# EAGLE design MDU(droid)v4.1 (EAGLE 9.1.3)

## Sheet 1 of 2: IC部
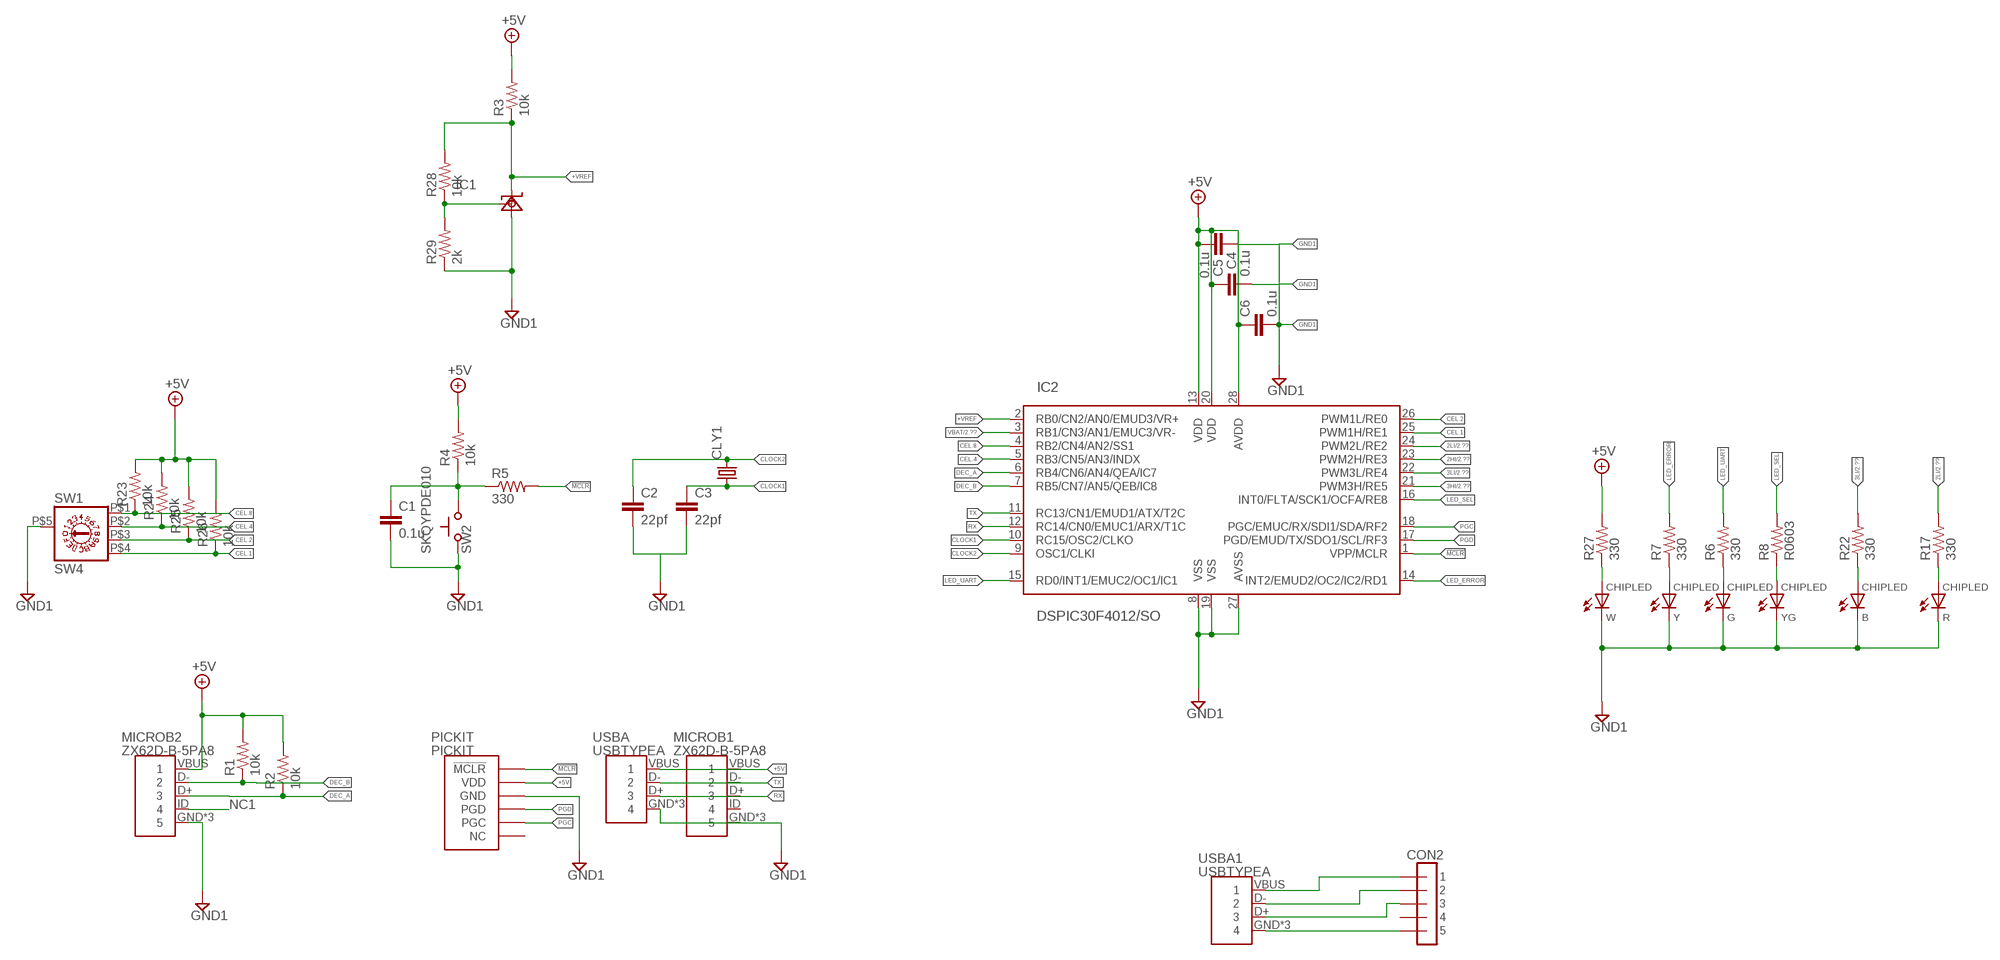
[diagram p0: schematic, sheet 1]

### Parts
B  CHIPLED  [CHIPLED_0603]
C1  0.1u  SOC  [C0603]
C2  22pf  SOC  [C0603]
C3  22pf  SOC  [C0603]
C4  0.1u  SOC  [C0603]
C5  0.1u  SOC  [C0603]
C6  0.1u  SOC  [C0603]
CLY1  CRYSTALHC49S  [HC49/S]
CON2  CON-5  [5-L]
G  CHIPLED  [CHIPLED_0603]
IC1  TA76431F  [SOT89]
IC2  DSPIC30F4012/SO  [SO-28W]
MICROB1  ZX62D-B-5PA8  [USB-B-MICRO-SMD]
MICROB2  ZX62D-B-5PA8  [USB-B-MICRO-SMD]
PICKIT  PICKIT  [1X06]
R  CHIPLED  [CHIPLED_0603]
R1  10k  SOR  [R0603]
R2  10k  SOR  [R0603]
R3  10k  SOR  [R0603]
R4  10k  SOR  [R0603]
R5  330  SOR  [R0603]
R6  330  SOR  [R0603]
R7  330  SOR  [R0603]
R8  R0603  [R0603]
R17  330  SOR  [R0603]
R22  330  SOR  [R0603]
R23  10k  R0603  [R0603]
R24  10k  R0603  [R0603]
R25  10k  R0603  [R0603]
R26  10k  R0603  [R0603]
R27  330  R0603  [R0603]
R28  10k  R0603  [R0603]
R29  2k  R0603  [R0603]
SW1  SW4  SC1010B  [DRS3016]
SW2  SKQYPDE010  [SKQYPDE010]
USBA  USBTYPEA  [USB-A-H]
USBA1  USBTYPEA  [USB-A-H]
W  CHIPLED  [CHIPLED_0603]
Y  CHIPLED  [CHIPLED_0603]
YG  CHIPLED  [CHIPLED_0603]

### Nets
2HI: IC2.23(PWM2H/RE3) ; also sheet 2
2LI [signal]: IC2.24(PWM2L/RE2) R17.2 ; also sheet 2
3HI [signal]: IC2.21(PWM3H/RE5) ; also sheet 2
3LI [signal]: IC2.22(PWM3L/RE4) R22.2 ; also sheet 2
!MCLR: IC2.1(VPP/MCLR) PICKIT.1(!MCLR) R5.2
+5V: C4.2 C5.1 C6.1 IC2.13(VDD) IC2.20(VDD) IC2.28(AVDD) MICROB1.VBUS MICROB2.VBUS PICKIT.2(VDD) R1.2 R2.2 R3.2 R4.2 R23.2 R24.2 R25.2 R26.2 R27.2 USBA.VBUS
+VREF: IC1.1(K) IC2.2(RB0/CN2/AN0/EMUD3/VR+) R3.1 R28.2
CEL.1 [signal]: IC2.25(PWM1H/RE1) R26.1 SW1.P$4
CEL.2 [signal]: IC2.26(PWM1L/RE0) R25.1 SW1.P$3
CEL.4 [signal]: IC2.5(RB3/CN5/AN3/INDX) R24.1 SW1.P$2
CEL.8 [signal]: IC2.4(RB2/CN4/AN2/SS1) R23.1 SW1.P$1
CLOCK1: C3.1 CLY1.1 IC2.10(RC15/OSC2/CLKO)
CLOCK2: C2.1 CLY1.2 IC2.9(OSC1/CLKI)
DEC_A: IC2.6(RB4/CN6/AN4/QEA/IC7) MICROB2.D+ R2.1
DEC_B: IC2.7(RB5/CN7/AN5/QEB/IC8) MICROB2.D- R1.1
GND1: B.C C1.2 C2.2 C3.2 C4.1 C5.2 C6.2 G.C IC1.2(A) IC1.2@1(A) IC2.8(VSS) IC2.19(VSS) IC2.27(AVSS) MICROB1.GND MICROB1.SHIELD1 MICROB1.SHIELD2 MICROB2.GND MICROB2.SHIELD1 MICROB2.SHIELD2 PICKIT.3(GND) R29.1 R.C SW1.P$5(C) SW2.SW1 USBA.GND USBA.SHLD1 USBA.SHLD2 W.C Y.C YG.C ; also sheet 2
LED_ERROR: IC2.14(INT2/EMUD2/OC2/IC2/RD1) R7.2
LED_SEL: IC2.16(INT0/FLTA/SCK1/OCFA/RE8) R8.2
LED_UART: IC2.15(RD0/INT1/EMUC2/OC1/IC1) R6.2
MCLR: C1.1 R4.1 R5.1 SW2.SW2
N$1: R27.1 W.A
N$2: G.A R6.1
N$3: R8.1 YG.A
N$4: IC1.3(REF) R28.1 R29.2
N$5: CON2.P$1 USBA1.VBUS
N$6: CON2.P$5 USBA1.GND USBA1.SHLD1 USBA1.SHLD2
N$7: CON2.P$2 USBA1.D-
N$8: R7.1 Y.A
N$9: R17.1 R.A
N$10: B.A R22.1
N$11: CON2.P$3 USBA1.D+
NC1: MICROB2.ID
PGC [signal]: IC2.18(PGC/EMUC/RX/SDI1/SDA/RF2) PICKIT.5(PGC)
PGD [signal]: IC2.17(PGD/EMUD/TX/SDO1/SCL/RF3) PICKIT.4(PGD)
RX: IC2.12(RC14/CN0/EMUC1/ARX/T1C) MICROB1.D+ USBA.D+
TX: IC2.11(RC13/CN1/EMUD1/ATX/T2C) MICROB1.D- USBA.D-
VBAT: IC2.3(RB1/CN3/AN1/EMUC3/VR-) ; also sheet 2
Unconnected: CON2.P$4 MICROB1.ID PICKIT.6(NC)

## Sheet 2 of 2: 駆動部
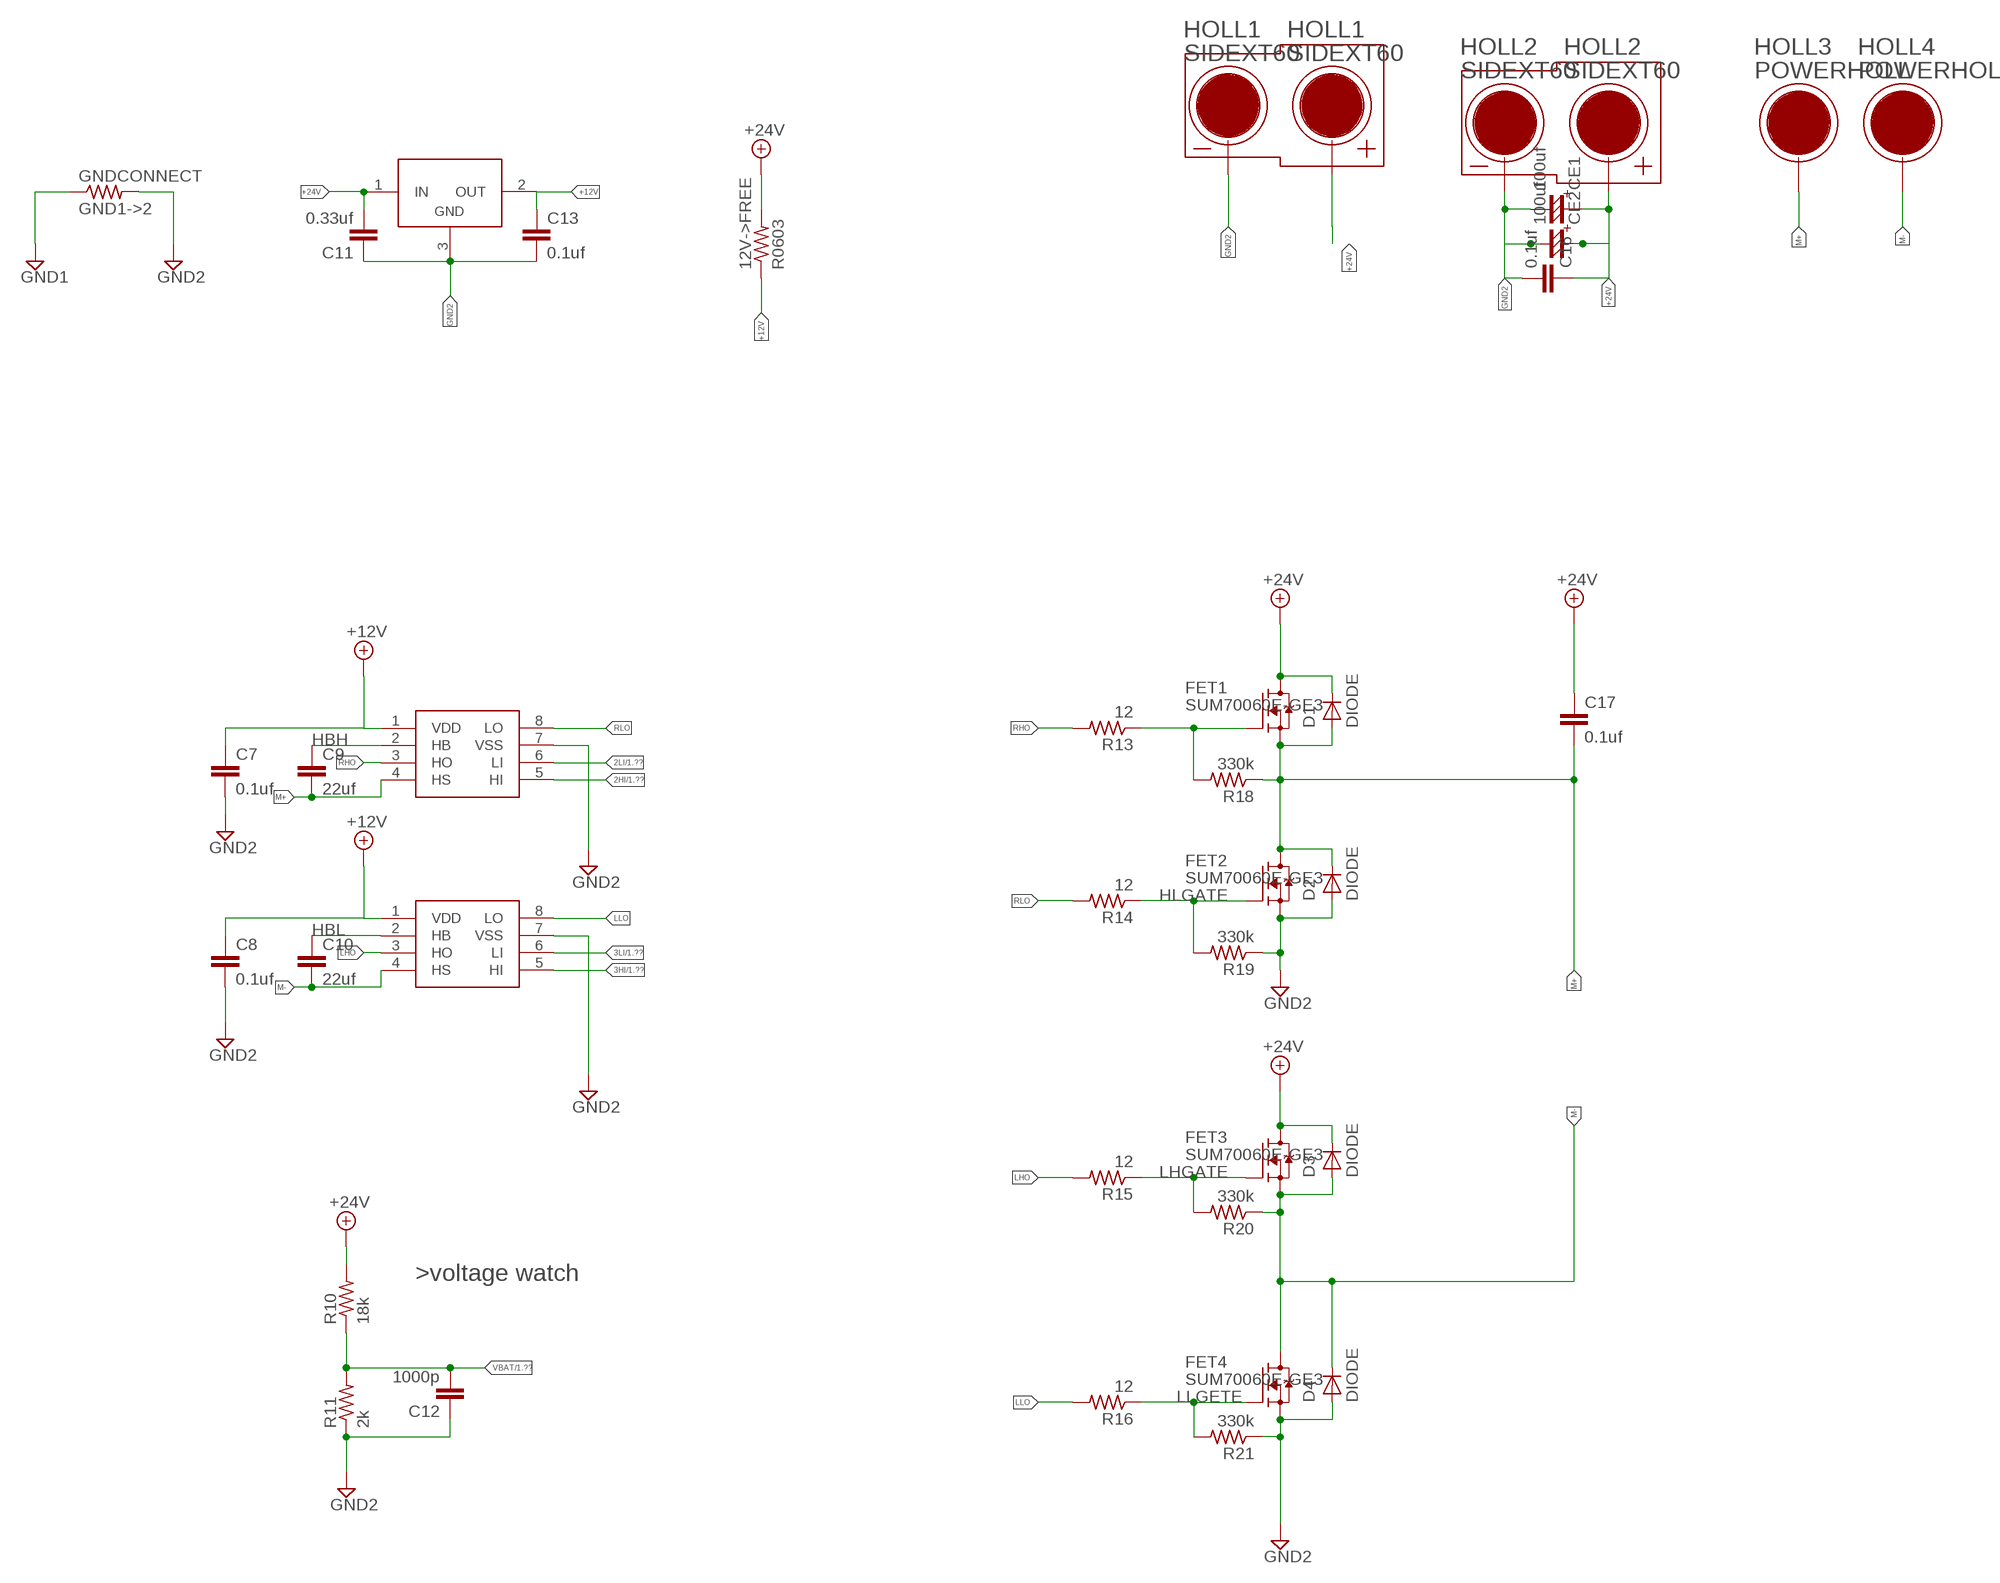
[diagram p1: schematic, sheet 2]

### Parts
12V->FREE  R0603  [R0603]
C7  0.1uf  SOC  [C0603]
C8  0.1uf  SOC  [C0603]
C9  22uf  SOC  [C0603]
C10  22uf  SOC  [C0603]
C11  0.33uf  SOC  [C0603]
C12  1000p  SOC  [C0603]
C13  0.1uf  SOC  [C0603]
C16  0.1uf  SOC  [C0603]
C17  0.1uf  SOC  [C0603]
CE1  100uf  CE1  [CE1]
CE2  100uf  CE1  [CE1]
D1  DIODE  [DO35-7A]
D2  DIODE  [DO35-7A]
D3  DIODE  [DO35-7A]
D4  DIODE  [DO35-7A]
FET1  SUM70060E-GE3  [TO263AB]
FET2  SUM70060E-GE3  [TO263AB]
FET3  SUM70060E-GE3  [TO263AB]
FET4  SUM70060E-GE3  [TO263AB]
GNDCONNECT  GND1->2  [R0603]
HOLL1  SIDEXT60  [SIDEXT60]
HOLL2  SIDEXT60  [SIDEXT60]
HOLL3  POWERHOLL  [POWERHOLL]
HOLL4  POWERHOLL  [POWERHOLL]
IC3  MC7812BD2TG  [TO263]
IC5  MIC4604  [SOIC8]
MIC4604  MIC4604  [SOIC8]
R10  18k  SOR  [R0603]
R11  2k  SOR  [R0603]
R13  12  SOR  [R0603]
R14  12  SOR  [R0603]
R15  12  SOR  [R0603]
R16  12  SOR  [R0603]
R18  330k  SOR  [R0603]
R19  330k  SOR  [R0603]
R20  330k  SOR  [R0603]
R21  330k  SOR  [R0603]

### Nets
2HI: MIC4604.5(HI) ; also sheet 1
2LI [signal]: MIC4604.6(LI) ; also sheet 1
3HI [signal]: IC5.5(HI) ; also sheet 1
3LI [signal]: IC5.6(LI) ; also sheet 1
+12V: 12V->FREE.1 C7.1 C8.1 C13.1 IC3.2(OUT) IC5.1(VDD) MIC4604.1(VDD)
+24V: 12V->FREE.2 C11.2 C16.1 C17.1 CE1.1(A) CE2.1(A) D1.C D3.C FET1.K(D) FET3.K(D) HOLL1.P$2 HOLL1.P$4 HOLL2.P$2 HOLL2.P$4 IC3.1(IN) R10.2
FETHHGATE: FET1.1(G) R13.1 R18.2
GND1: GNDCONNECT.1 ; also sheet 1
GND2: C7.2 C8.2 C11.1 C12.1 C13.2 C16.2 CE1.2(C) CE2.2(C) D2.A D4.A FET2.2(S) FET4.2(S) GNDCONNECT.2 HOLL1.P$1 HOLL1.P$3 HOLL2.P$1 HOLL2.P$3 IC3.3(GND) IC5.7(VSS) MIC4604.7(VSS) R11.1 R19.1 R21.1
HBH: C9.1 MIC4604.2(HB)
HBL: C10.1 IC5.2(HB)
HLGATE: FET2.1(G) R14.1 R19.2
LHGATE: FET3.1(G) R15.1 R20.2
LHO: IC5.3(HO) R15.2
LLGETE: FET4.1(G) R16.1 R21.2
LLO [signal]: IC5.8(LO) R16.2
M+: C9.2 C17.2 D1.A D2.C FET1.2(S) FET2.K(D) HOLL3.P$1 MIC4604.4(HS) R18.1
M-: C10.2 D3.A D4.C FET3.2(S) FET4.K(D) HOLL4.P$1 IC5.4(HS) R20.1
RHO: MIC4604.3(HO) R13.2
RLO: MIC4604.8(LO) R14.2
VBAT: C12.2 R10.1 R11.2 ; also sheet 1

### Notes on the sheet
- >voltage watch

## Library data of the parts
12V->FREE R8 R23-R29 = rcld_org:R0603
B G R W Y YG = LED_org:CHIPLED
C1-C13 C16 C17 = rcld.original:SOC
CE1 CE2 = _RC:CE
CLY1 = crystal:CRYSTAL: CRYSTAL; OC_FARNELL: 1667008; OC_NEWARK: unknown
CON2 = _connecter:CON-5
D1-D4 = rcld_org:DIODE
FET1-FET4 = fet:SUM70060E-GE3
GNDCONNECT = con(flygon):GND1->2
HOLL1 HOLL2 = 穴:SIDEXT60
HOLL3 HOLL4 = 穴:POWERHOLL
IC1 = リファレンスIC:TA76431F
IC2 = microchip-dspic:DSPIC30F4012: dsPIC Motion Controller DSC
IC3 = 三端子レギュレータ:MC7812BD2TG
IC5 MIC4604 = 非絶縁ハーフブリッジ:MIC4604
MICROB1 MICROB2 = USB:ZX62D-B-5PA8
PICKIT = con(flygon):PICKIT
R1-R7 R10 R11 R13-R22 = rcld.original:SOR
SW1 = switch_org:SC1010B
SW2 = 表面実装switch:SKQYPDE010
USBA USBA1 = USB:USBTYPEA

## Net classes
2 signal: width 0.2 mm
3 smpower: width 0.5 mm

## Board
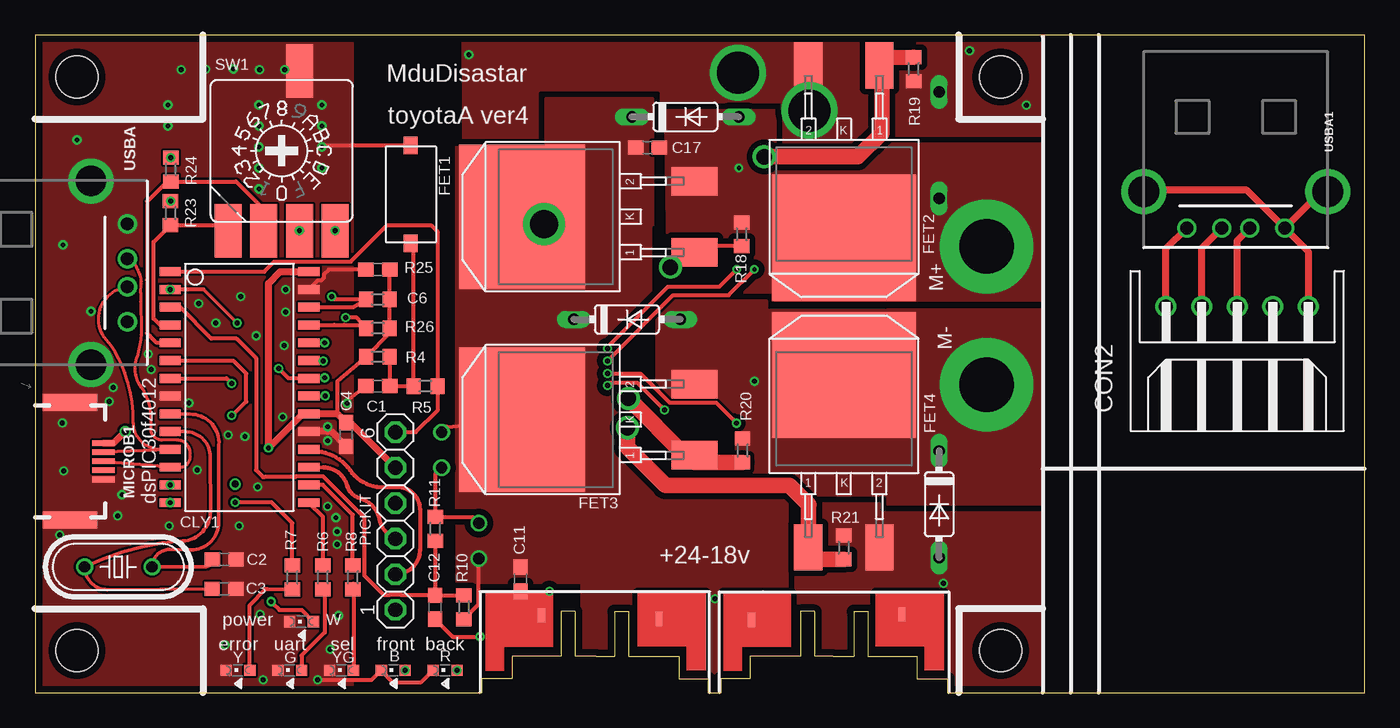
[diagram p2: board, top side]
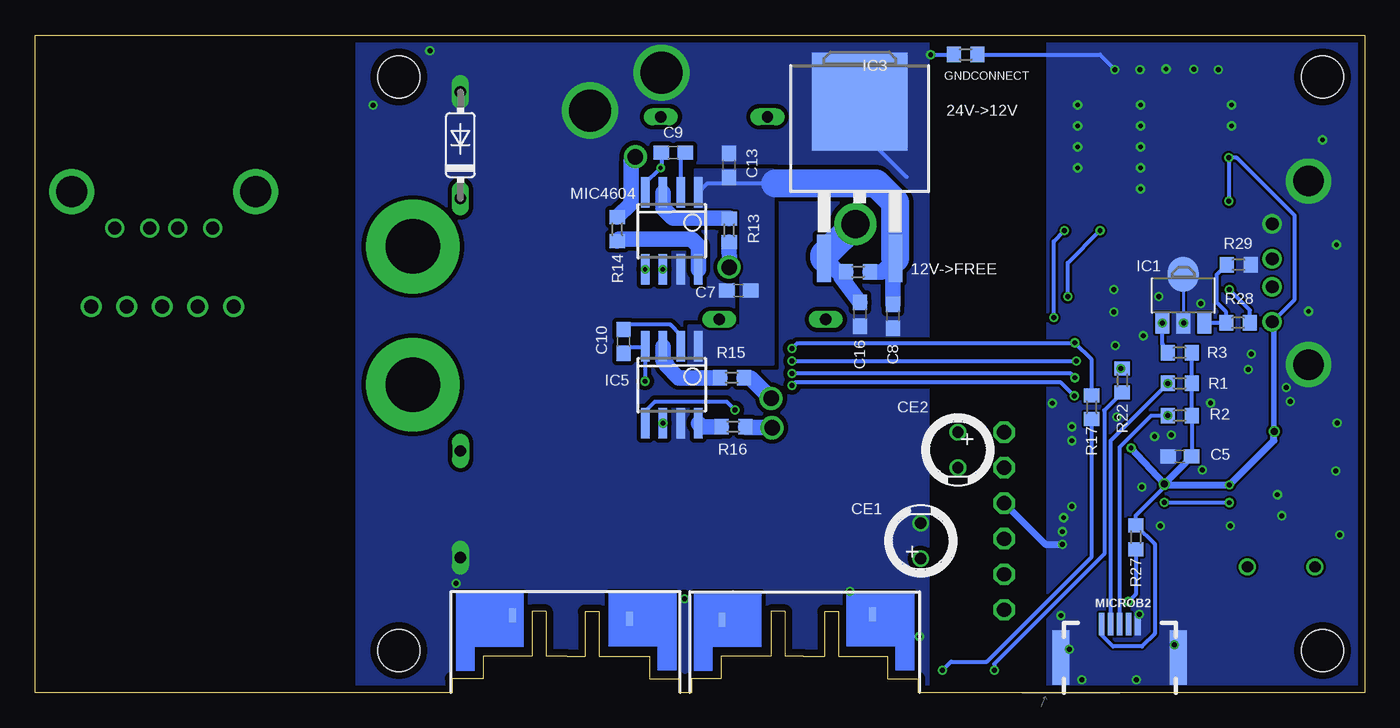
[diagram p3: board, bottom side, seen from below]

Size 95 x 47 mm. Coordinates in mm from the lower left corner, seen from the top.
Outline: 31.9,0 0,0 0,47 95,47 95,0 65.2,0
Outline: 48.1,0 49,0
Copper layers (1*16): Top 0.035mm / dielectric 1.6mm / Bottom 0.035mm
Design rules "Elecrow_2-layer_PCB_eagle_rule": minimum track width 6mil, minimum drill 12mil, track to track 6mil, track to pad 6mil, pad to pad 6mil, via to via 8mil, smd to smd 0mil, copper to edge 20mil, drill to drill 10mil, minimum pad ring 6mil, minimum via ring 6mil, stop-mask expansion 0mil, vias tented up to drill 100mil, thermal gap 10mil
Holes 3 mm at 3,3 3,44 69,44 69,3

### Footprints (pad centres in the part's own frame; a part is rotated, then mirrored left to right if it is on the bottom)
R0603 = smd 1 x 1.1: 1 -0.85,0; 2 0.85,0
CHIPLED_0603 = smd 0.8 x 0.8: A 0,-0.85; C 0,0.85
C0603 = smd 1.1 x 1: 1 -0.85,0; 2 0.85,0
CE1 = drill 0.8: 1 -1.27,0; 2 1.27,0
HC49/S = drill 0.813: 1 -2.413,0; 2 2.413,0
5-L = drill 1: P$1 -5.08,0; P$2 -2.54,0; P$3 0,0; P$4 2.54,0; P$5 5.08,0
DO35-7A = drill 0.813 long: A 3.81,0; C -3.81,0
TO263AB = smd 2.032 x 3.302: 1 -2.54,-7.62; 2 2.54,-7.62 | smd 10.287 x 9.017: K 0,4.699
SIDEXT60 = smd 0.5 x 1: P$1 -3.79,2.93; P$2 4.572,2.657 | smd 0.5 x 1 bottom: P$3 -4.83,3; P$4 5.9,2.6
POWERHOLL = drill 3.9 pad 6.7: P$1 0,0
SOT89 = smd 1 x 1.5: 1 -1.499,-1.981; 2 0,-1.981; 3 1.499,-1.981 | smd 2.2 x 2.5: 2@1 0,1.5
SO-28W = smd 0.635 x 1.524: 1 -7.62,-4.953; 2 -6.35,-4.953; 3 -5.08,-4.953; 4 -3.81,-4.953; 5 -2.54,-4.953; 6 -1.27,-4.953; 7 0,-4.953; 8 1.27,-4.953; 9 2.54,-4.953; 10 3.81,-4.953; 11 5.08,-4.953; 12 6.35,-4.953; 13 7.62,-4.953; 14 8.89,-4.953; 15 8.89,4.953; 16 7.62,4.953; 17 6.35,4.953; 18 5.08,4.953; 19 3.81,4.953; 20 2.54,4.953; 21 1.27,4.953; 22 0,4.953; 23 -1.27,4.953; 24 -2.54,4.953; 25 -3.81,4.953; 26 -5.08,4.953; 27 -6.35,4.953; 28 -7.62,4.953
TO263 = smd 1 x 3.4: 1 -2.54,-6.6; 2 2.54,-6.6 | smd 6.8 x 7: 3 0,4.6
SOIC8 = smd 0.6 x 2.2: 1 -1.905,-2.75; 2 -0.635,-2.75; 3 0.635,-2.75; 4 1.905,-2.75; 5 1.905,2.75; 6 0.635,2.75; 7 -0.635,2.75; 8 -1.905,2.75
USB-B-MICRO-SMD = smd 1.6 x 0.4: D+ 2.9,0; D- 2.9,0.65; GND 2.9,-1.3; ID 2.9,-0.65; VBUS 2.9,1.3 | smd 3.9 x 1.2: SHIELD1 0.5,4.2; SHIELD2 0.5,-4.2
1X06 = drill 1.016 octagon: 1 -6.35,0; 2 -3.81,0; 3 -1.27,0; 4 1.27,0; 5 3.81,0; 6 6.35,0
DRS3016 = smd 1.93 x 3.81: P$1 -3.81,-5.715; P$2 -1.27,-5.715; P$3 1.27,-5.715; P$4 3.81,-5.715; P$5 1.27,5.715
SKQYPDE010 = smd 1.27 x 1: SW1 -3.5,0; SW2 3.5,0
USB-A-H = drill 0.914: D+ 2.6,1; D- 2.6,-1; GND 2.6,3.5; VBUS 2.6,-3.5 | drill 2.2: SHLD1 0,-6.57; SHLD2 0,6.57

### Placement (x,y rotation side)
12V->FREE  36.19,30.07 180 bottom
B  25.6,1.6 90 top
C1  24.5,21.9 180 top
C2  13.53,9.51 0 top
C3  13.51,7.4 0 top
C4  22.24,18.44 90 top
C5  13.2,16.87 180 bottom
C6  24.5,30.25 180 top
C7  44.72,28.75 180 bottom
C8  33.7,26.9 270 bottom
C9  49.4,38.59 180 bottom
C10  52.95,25.1 270 bottom
C11  34.71,8.11 90 top
C12  28.6,6.1 90 top
C13  45.4,37.68 90 bottom
C16  36.06,27.04 270 bottom
C17  43.77,38.95 0 top
CE1  31.71,10.84 90 bottom
CE2  29.05,17.34 270 bottom
CLY1  5.96,8.98 0 top
CON2  85.9,27.6 0 top
D1  46.47,41.16 0 top
D2  64.6,39.13 90 bottom
D3  42.3,26.68 0 top
D4  64.6,13.46 270 top
FET1  39.5,34 90 top
FET2  57.8,37.2 180 top
FET3  39.5,19.5 90 top
FET4  57.8,18 0 top
G  18.2,1.6 90 top
GNDCONNECT  28.5,45.6 180 bottom
HOLL1  40,2.6 0 top
HOLL2  57.1,2.6 0 bottom
HOLL3  68,31.88 0 top
HOLL4  68,22 0 top
IC1  12.95,28.39 0 bottom
IC2  14.61,22.46 270 top
IC3  36.07,37.64 0 bottom
IC5  49.5,22 180 bottom
MIC4604  49.5,33 180 bottom
MICROB1  2,16.53 0 top
MICROB2  17.5,2 90 bottom
PICKIT  25.75,12.26 270 top
R  29.3,1.6 90 top
R1  13.2,22.1 0 bottom
R2  13.2,19.8 0 bottom
R3  13.2,24.3 0 bottom
R4  24.5,24 180 top
R5  27.9,21.9 0 top
R6  20.56,8.23 90 top
R7  18.38,8.23 90 top
R8  22.7,8.23 90 top
R10  30.64,6.1 270 top
R11  28.6,11.7 270 top
R13  45.4,33.04 90 bottom
R14  53.4,33.12 270 bottom
R15  45.2,22.5 180 bottom
R16  45.1,19 180 bottom
R17  19.5,20.4 90 bottom
R18  50.5,32.75 270 top
R19  62.78,44.56 90 top
R20  50.55,17.3 270 top
R21  57.8,10.37 270 top
R22  17.31,22.31 90 bottom
R23  9.69,34.27 90 top
R24  9.7,37.38 90 top
R25  24.5,28.11 0 top
R26  24.5,26.05 0 top
R27  16.34,11.1 90 bottom
R28  9.03,26.44 0 bottom
R29  8.99,30.58 180 bottom
SW1  17.62,38.72 0 top
SW2  26.86,35.6 270 top
USBA  4,30 0 top
USBA1  85.8,35.8 270 top
W  19.04,5.07 90 top
Y  14.5,1.6 90 top
YG  21.9,1.6 90 top

### Tracks (layer width: path | path; a pad name or v marks a point on that pad's centre or on a via)
2HI  (via drill 0.3, 0.35)
  Top 0.3: v20.6,23.7 19.59,23.7 IC2.23 | MIC4604.5 49.55,28.4 45.6,28.4 v40.9,23.7
  Bottom 0.3: v40.9,23.7 v20.6,23.7
  other vias: 51.41,30.25
2LI  (via drill 0.3, 0.35)
  Top 0.3: IC2.24 v20.7,25 | MIC4604.6 48.88,29 45.2,29 40.91,24.7 v40.91,24.59
  Bottom 0.3: R17.2 19.5,23.8 v20.7,25 20.75,25 20.8,24.95 40.55,24.95 | 40.55,24.95 | 40.55,24.95 v40.91,24.59
  other vias: 50.13,30.25
3HI  (via drill 0.35)
  Top 0.3: IC2.21 20.72,21.19 v20.74,21.21 | v44.98,20.2 43.02,22.15 41.11,22.15 v40.9,21.94
  Bottom 0.3: v20.74,21.21 21.69,22.16 40.69,22.16 v40.9,21.94 | IC5.5 51.41,20.09 50.7,20.8 45.58,20.8 v44.98,20.2
3LI  (via drill 0.35)
  Top 0.3: v20.7,22.5 19.6,22.5 IC2.22 18.11,22.46 v17.41,23.16 | v40.9,22.8 43.27,22.8 45.34,20.72 48.68,20.72 50.13,19.27 IC5.6
  Bottom 0.3: v20.7,22.5 21,22.8 v40.9,22.8 | v17.41,23.16 R22.2
  other vias: 50.13,19.25
!MCLR
  Top 0.3: PICKIT.1 27.21,18.61 28.8,20.2 28.8,22.05 R5.2 28.75,32.95 28.3,33.4 25.16,33.4 22.56,30.8 17.1,30.8 16.38,30.08 IC2.1
+5V  (via drill 0.35, 0.5)
  Top 0.3: 21.6,19.92 21.6,22.25 R4.2 25.35,25.7 R26.2 R25.2 C6.1
  Top 0.5: MICROB1.VBUS 5.61,17.83 v6.45,18.66 | IC2.28 17.51,30.08 16.68,29.25 v16.68,17.48 19.12,19.92 | IC2.20 19.12,19.92 | IC2.20 21.6,19.92 21.61,19.92 C4.2 22.53,19.29 PICKIT.2 | IC2.20 19.12,19.92
  Bottom 0.3: R3.2 R1.2 R2.2 C5.1 | USBA.VBUS 5,28.1 5,34.1 9.13,38.23 R24.2 R23.2 | v6.45,18.66 v6.45,18.67 6.48,18.67 | MICROB2.VBUS 18.8,4.12 17.98,3.3 15.9,3.3 15,4.2 15,10.61 R27.2 16.34,12.66 16.1,12.9 14.3,14.7 v14.3,14.9 14.24,14.84 14.04,14.84
  Bottom 0.406: 6.48,18.67 6.48,26.38 USBA.VBUS
  Bottom 0.5: 6.48,18.67 6.48,18.02 IC2.13 14.04,14.84 | v16.68,17.48 v14.3,14.9 14.3,14.92 C5.1
  other vias: 9.66,14.84 9.7,38.23 9.69,35.12
+12V
  Bottom 0.3: MIC4604.1 46.95,36.4 42.1,36.4
  Bottom 1.1: 12V->FREE.1 34.5,30.07 IC3.2 33.7,30.87 C8.1
  Bottom 2: IC3.2 33.53,35.03 34.9,36.4 42.1,36.4
  pour Bottom (rank 3, no thermals): 47.84,37.34 47.84,34.38 44.43,34.38 44.4,34.38 44.4,37.34
  pour Bottom (no thermals): 44.59,26.2 48.3,26.2 48.3,23.47 42.41,23.47 42.24,23.47 42.24,37.32 43.91,37.34 44.59,37.34
+24V  (via drill 0.35, 2)
  Top 0.3: R10.2 31.71,6.32 CE1.1 | CE2.1 29.44,19 FET3.K
  Top 2: FET1.K 35.3,33.5 v36.38,33.5
  Bottom 1.1: IC3.1 37.64,30.07 12V->FREE.2 37.42,29.69 C16.1
  Bottom 2: v36.38,33.5 38.61,31.27 IC3.1
  other vias: 48.6,6.7
  pour Top (isolate 0.406, rank 2, no thermals): 30.1,13 30.1,39.02 44,39.27 44,13
  pour Top (no thermals): 36.53,42.5 44.12,42.5 44.12,33.39 36.53,33.38
  pour Top (isolate 0.406, rank 2, no thermals): 53.8,11.5 53.8,0.4 39,0.4 39,7.8 30.1,7.8 30.1,15.1 49.9,15.1 49.9,13.8 53.8,13.8
  pour Bottom (no thermals): 55.2,6.1 55.2,0 43.3,0 41.9,0 41.9,6.8 55.2,6.8
+VREF  (via drill 0.35)
  Top 0.254: IC1.1 12.05,28.81
  Top 0.3: 12.05,28.81 IC2.2
  Bottom 0.3: R3.1 14.45,24.93 IC1.1 | R28.2 8.18,27.33 IC2.2
  other vias: 14.45,26.41 9.66,28.81
CEL.1  (via drill 0.35)
  Top 0.3: IC2.25 19.7,26.27 21.4,26.27 22.1,26.27 23.52,26.27 R26.1 22.99,26.8 v22.2,26.8
  Bottom 0.3: v22.2,26.8 22.2,32.24 SW1.P$4
  other vias: 21.43,33.01
CEL.2  (via drill 0.35)
  Top 0.3: IC2.26 22.76,27.54 R25.1 21.39,28.11 v21.2,28.3
  Bottom 0.3: v21.2,28.3 21.2,30.7 SW1.P$3
  other vias: 18.89,33.01
CEL.4
  Top 0.3: IC2.5 8.7,25 | 8.7,25 8.2,25.5 | 8.2,25.5 | 8.7,25 | 8.2,25.5 8.02,25.68 8.02,29.49 8,29.51 8,35.1 9.43,36.53 R24.1 14.37,36.53 16.36,34.55 SW1.P$2
CEL.8
  Top 0.3: IC2.4 8.93,26.27 8.47,26.73 8.47,32.2 R23.1 13.4,33.42 SW1.P$1
CLOCK1
  Top 0.254: C3.1 5.17,7.35 arc-90 CLY1.1 arc-22 10.55,10.83 arc87 12.54,12.96 12.52,16.87 arc90 10.74,18.65 IC2.10
CLOCK2
  Top 0.254: IC2.9 arc3 11.07,19.9 arc-95 13.14,17.7 13.13,12.24 13.13,12.15 arc-90 11.17,10.19 9.61,10.22 | 9.61,10.22 arc90 CLY1.2 12.15,8.98 arc90 C2.1 | 9.61,10.22 arc90 9.61,10.22
DEC_A  (via drill 0.35)
  Top 0.3: IC2.6 14.17,23.73 15.1,22.8 15.1,20.8 14.1,19.8 R2.1
  Bottom 0.3: MICROB2.D+ 17.5,17.55 15.25,19.8 R2.1
  other vias: 14.05,19.8
DEC_B  (via drill 0.35)
  Top 0.2: IC2.7 10.08,22.46
  Top 0.3: R1.1 13.69,22.46 10.08,22.46
  Bottom 0.3: R1.1 18.15,18 MICROB2.D-
  other vias: 14.05,22.1
FETHHGATE  (via drill 1.1)
  Top 0.3: R18.2 47.56,31.9 FET1.1
  Top 1.1: v45.4,30.4 46.46,31.46 FET1.1
  Bottom 1.1: R13.1 45.37,30.43 v45.4,30.4
GND1  (via drill 0.35)
  Top 0.3: R.C 27.55,0.7 25.6,0.7 24.73,1.57 | C1.2 22.3,20.85 v22.3,20.68 | SW2.SW1 20.61,39.1 v20.5,39 | C6.2 21,30.25 20.63,29.87 20.63,29.64 20.45,29.46 20.21,29.46 IC2.27 | v20.2,0.9 22.22,0.9 22.23,0.9 23.27,0.9 23.28,0.9 24.05,0.9 24.73,1.57 | 24.73,1.57 B.C
  Top 0.5: IC2.19 21.18,18.65 C4.1
  Bottom 0.3: GNDCONNECT.1 18.91,45.6 v17.83,44.52
  Bottom 0.5: v21.6,10.6 22.82,10.6 PICKIT.3
  other vias: 16,36 20.5,37.5 16,37.5 16,39 16,40.5 20.5,40.5 20.5,42 16,42 2,32 3,39.5 2.06,15.84 1.96,19.26 6.22,14.14 4,27.25 9.5,40.5 9.5,42 5.92,12.64 1.76,11.26 12.92,26.42 10.45,44.52 12.2,44.56 14.18,44.57 16.04,44.52 21.5,12.5 21.6,11.5 20.9,13.3 16.1,5.6 17.9,28.8 20.9,19 15.9,14.7 15,18.3 17.7,19.7 20.9,18 16.3,0.9 13.6,3.4 9.6,11.9 14.6,11.9 11.6,15.9 13.8,18.4 11,20.7 8.3,23.1 8.1,24.2 5.3,20.8 5.6,21.8 14.7,28.3 17.9,27.2 15.8,25.5 11.7,27.8 17.8,24.8 21.7,5.5 21.1,3.1
  pour Bottom (rank 6, no thermals): 0,0 22.64,-0.39 22.64,46.64 0.05,47 0.05,47.05
  pour Top (no thermals): 0,47 0,0 22.7,0 22.7,47 19.5,47
GND2  (via drill 0.35, 3)
  Top 0.3: CE2.2 28.6,15.62 R11.1 31.27,12.55 CE1.2 | v31.8,4 29.85,4 C12.1
  Bottom 0.3: 32.72,36.85 35.37,39.5 | v31,45.6 GNDCONNECT.2
  other vias: 66.78,45.88 70.83,41.99 50.24,44.3 36.76,7.24 64.9,7.8 55.34,41.6
  pour Top (isolate 0.406, rank 5, no thermals): 30.57,47 30.77,15.5 32.7,15.5 32.5,0 72.02,0 72.02,47
  pour Bottom (isolate 0.305, rank 6, no thermals): 31.2,47 31.2,-1.2 72,-1.2 72,10.3 72,47 61.5,47
HBH
  Bottom 0.3: C9.1 48.87,38.27 MIC4604.2
HBL
  Bottom 0.3: IC5.2 48.87,25.57 49.6,26.3 52.6,26.3 C10.1
HLGATE  (via drill 1.1)
  Top 1: 60.8,45.28 FET2.1
  Top 1.1: v52.1,38.3 58.8,38.3 60.5,40 60.5,44.66 FET2.1 | R19.2 60.9,45.38 60.8,45.28
  Bottom 1.1: R14.1 52.41,34.96 52.41,37.99 v52.1,38.3
LED_ERROR  (via drill 0.35)
  Top 0.3: R7.2 18.38,12.12 16.9,13.6 v14.3,13.6
  Bottom 0.3: IC2.14 9.69,13.6 v14.3,13.6
  other vias: 9.66,13.57
LED_SEL
  Top 0.3: R8.2 22.7,12.7 20.56,14.84 IC2.16
LED_UART
  Top 0.3: IC2.15 20.56,12.57 R6.2
LHGATE  (via drill 1.1)
  Top 1.1: R20.2 47.12,16.45 FET3.1 46.46,16.96 v42.4,21.02
  Bottom 1.1: R15.1 43.88,22.5 v42.4,21.02
LHO
  Bottom 1.1: R15.2 49.01,22.5 49.87,23.36 49.87,23.47 50.13,23.73 IC5.3
LLGETE  (via drill 1.1)
  Top 1.1: R21.2 55.85,9.52 FET4.1 55.26,13.36 55.3,13.4 53.9,14.8 45.04,14.8 42.33,17.51 v42.33,18.93
  Bottom 1.1: v42.33,18.93 44.18,18.93 R16.1
LLO
  Bottom 1.1: R16.2 47.34,19 IC5.8
M+  (via drill 0.3)
  Bottom 0.3: MIC4604.4 51.41,36.4 v50.3,37.5 50.25,37.55 C9.2
  pour Top (isolate 0.406, rank 2, no thermals): 45,41.6 45.21,31.4 50.47,31.4 50.47,28.05 64.65,28.05 72,28.05 72,39.2 59,39.2 52.9,39.2 52.9,41.6 47.5,41.6 47.4,41.6
M-  (via drill 0.35)
  Bottom 0.3: IC5.4 51.41,24.7 | 51.41,24.7 v51.41,22.25 | C10.2 52.5,24.7 51.41,24.7
  pour Top (isolate 0.305, rank 3, no thermals): 63.03,27.35 50.02,27.36 50.05,14.1 63.03,14.09
  pour Top (isolate 0.406, rank 2, no thermals): 60.93,13.4 60.91,27.4 71.98,27.4 72.01,13.4
  pour Top (no thermals): 44.4,20.1 52.3,20.1 52.3,21.2 52.3,28 49.1,28 44.4,28 44.4,23.8 44.4,23.1
MCLR
  Top 0.3: R4.1 C1.1 R5.1 27.05,31.91 SW2.SW2
N$1  (via drill 0.35)
  Top 0.3: W.A 19.06,5.9 17.47,5.9 16.98,6.38 v16.87,6.5
  Bottom 0.3: v16.87,6.5 16.34,7.03 R27.1
N$2
  Top 0.3: R6.1 20.7,7.72 20.7,4.3 19.05,2.65 G.A
N$3
  Top 0.3: R8.1 22.75,7.8 YG.A
N$4
  Bottom 0.3: IC1.3 9.91,26.41 R28.1 9.88,27.18 10.56,27.86 10.56,29.86 R29.2
N$5
  Top 0.5: CON2.P$1 80.82,31.72 USBA1.VBUS
N$6
  Top 0.5: CON2.P$5 90.98,31.52 USBA1.GND | USBA1.GND 91.9,35.8 USBA1.SHLD2 | USBA1.GND 86.6,35.9 79.33,35.9 USBA1.SHLD1
N$7
  Top 0.5: CON2.P$2 83.36,31.76 USBA1.D-
N$8
  Top 0.3: Y.A 15.35,6.25 16.5,7.4 16.6,7.4 R7.1
N$9  (via drill 0.35)
  Bottom 0.3: R.A 29.55,2.2 27,2.2 19.5,9.7 R17.1
  other vias: 30.15,1.6
N$10  (via drill 0.35)
  Bottom 0.3: R22.1 18.6,20.17 18.6,9.9 26.45,2.05 B.A
  other vias: 26.45,1.6
N$11
  Top 0.5: CON2.P$3 85.9,32.3 USBA1.D+
PGC
  Top 0.3: IC2.18 20.5,17.2 arc-44 22.5,15.9 arc62 25.2,14.7 25.9,14.7 arc-90 27.5,13.1 27.5,10.2 arc-90 PICKIT.5
PGD
  Top 0.3: IC2.17 20.6,16.1 arc-74 22.3,14.8 arc59 23.2,13.9 arc-62 24.6,12.4 arc55 PICKIT.4
RHO
  Bottom 1.1: R13.2 45.38,33.9 46.18,33.9 | 46.18,33.9 | 46.18,33.9 49.41,33.9 50.13,34.63 MIC4604.3
RLO
  Bottom 1.1: MIC4604.8 47.59,31.89 48.1,32.4 53.27,32.4 R14.2
RX
  Top 0.2: IC2.12 10.35,16.11 arc90 11.09,16.85 11.09,17.11 arc90 10.15,18.05 9.07,18.05 arc-90 8.29,18.83 8.29,18.92 | 8.29,18.92 arc-90 8.29,18.92 | 8.29,18.92 8.29,19.71 arc36 7.62,21.78 arc-55 7.29,23.98 arc17 7.6,26.1 7.6,26.61 arc-8 7.56,28.57 7.59,29.21 arc63 USBA.D+
  Top 0.254: MICROB1.D+ IC2.12
TX
  Top 0.2: IC2.11 8.95,17.38 arc-90 7.03,19.3 arc19 6.42,22.89 arc21 5.1,25.2 arc-123 USBA.D-
  Top 0.254: IC2.11 MICROB1.D-
VBAT
  Top 0.3: R11.2 C12.2 | C12.2 R10.1 | C12.2 26.21,6.95 26.19,6.97 25.31,6.97 25.29,6.95 24.95,6.95 23.55,8.35 23.55,12.49 20.58,15.46 18.68,15.46 18.62,15.4 16.4,15.4 16.3,15.4 15.8,15.9 15.8,23.9 14.4,25.3 12.6,25.3 10.36,27.54 IC2.3

### Text on the board
tPlace: MduDisastar | toyotaA ver4 | M+ | M- | 6 | dsPIC30f4012 | +24-18v | 1 | power | W | error | uart | sel | front | back | YG | B | R
bPlace: 24V->12V